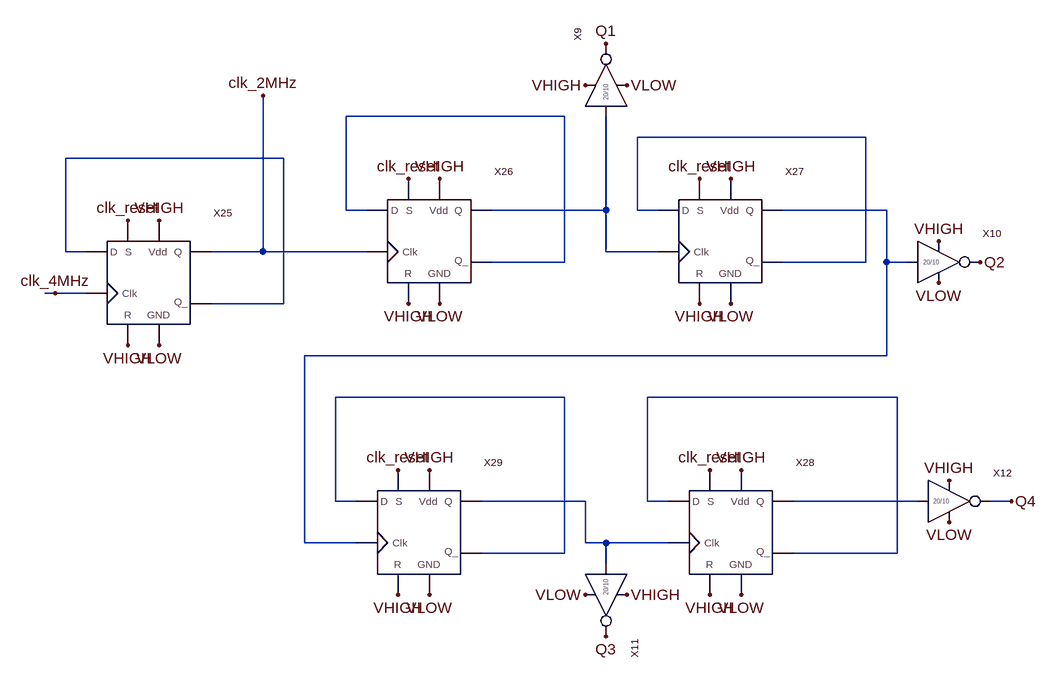
[diagram p0: schematic counter.asc]
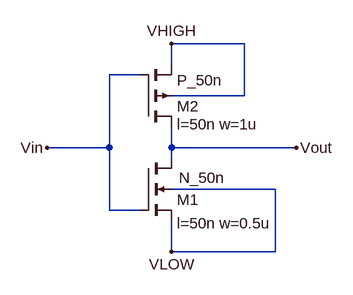
[diagram p1: sub-circuit inverter.asc]
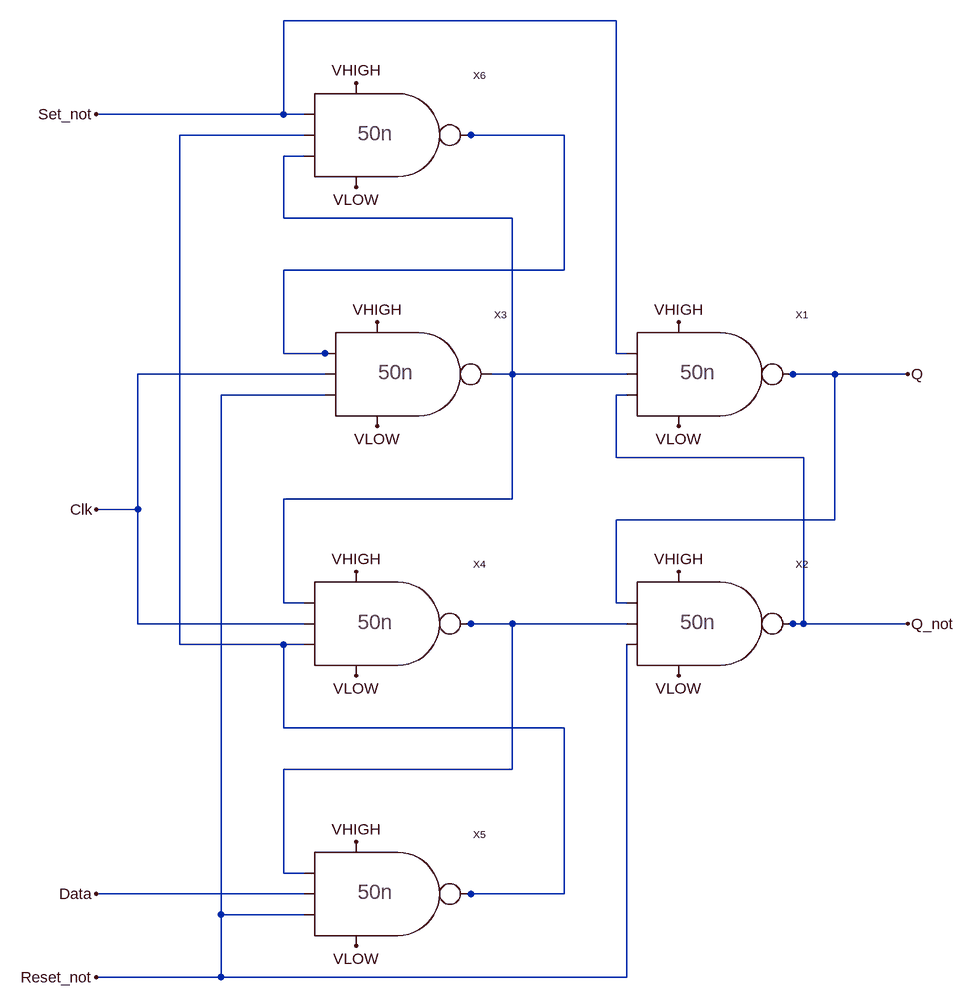
[diagram p2: sub-circuit ti_dff.asc]
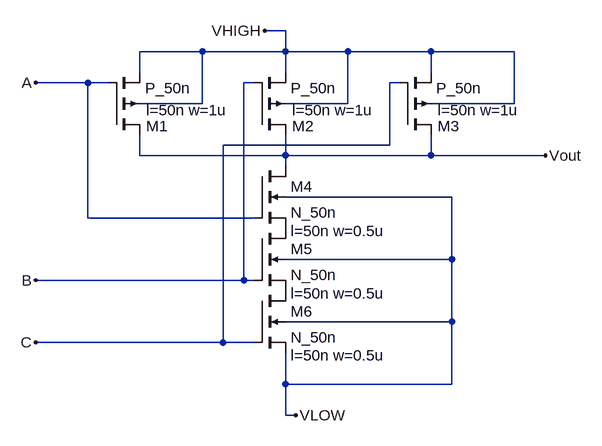
[diagram p3: sub-circuit nand3.asc]
counter.asc, the LTspice schematic file:
Version 4
SHEET 1 3052 1676
WIRE 720 -112 384 -112
WIRE 1184 -80 832 -80
WIRE 288 -48 -48 -48
WIRE 384 32 384 -112
WIRE 416 32 384 32
WIRE 784 32 784 -112
WIRE 784 32 608 32
WIRE 832 32 832 -80
WIRE 864 32 832 32
WIRE 1216 32 1056 32
WIRE -48 96 -48 -48
WIRE -16 96 -48 96
WIRE 256 96 256 -144
WIRE 256 96 176 96
WIRE 416 96 256 96
WIRE 784 96 784 32
WIRE 864 96 784 96
WIRE 720 112 720 -112
WIRE 720 112 608 112
WIRE 1184 112 1184 -80
WIRE 1184 112 1056 112
WIRE 1216 112 1216 32
WIRE 1248 112 1216 112
WIRE -64 160 -80 160
WIRE -16 160 -64 160
WIRE 288 176 288 -48
WIRE 288 176 176 176
WIRE 1216 256 1216 112
WIRE 1216 256 320 256
WIRE 720 320 368 320
WIRE 1232 320 848 320
WIRE 368 480 368 320
WIRE 400 480 368 480
WIRE 752 480 592 480
WIRE 848 480 848 320
WIRE 880 480 848 480
WIRE 1264 480 1072 480
WIRE 1408 480 1376 480
WIRE 320 544 320 256
WIRE 400 544 320 544
WIRE 752 544 752 480
WIRE 784 544 752 544
WIRE 880 544 784 544
WIRE 720 560 720 320
WIRE 720 560 592 560
WIRE 1232 560 1232 320
WIRE 1232 560 1072 560
WIRE 784 576 784 544
FLAG 784 -224 Q1
FLAG 1360 112 Q2
FLAG 784 688 Q3
FLAG 1408 480 Q4
FLAG 96 240 VLOW
FLAG 48 240 VHIGH
FLAG 96 48 VHIGH
FLAG 528 -16 VHIGH
FLAG 480 176 VHIGH
FLAG 752 -160 VHIGH
FLAG 528 176 VLOW
FLAG 816 -160 VLOW
FLAG 944 432 clk_reset
FLAG 464 432 clk_reset
FLAG 480 -16 clk_reset
FLAG 48 48 clk_reset
FLAG 928 -16 clk_reset
FLAG 976 -16 VHIGH
FLAG 992 432 VHIGH
FLAG 944 624 VHIGH
FLAG 464 624 VHIGH
FLAG 512 624 VLOW
FLAG 992 624 VLOW
FLAG 976 176 VLOW
FLAG 928 176 VHIGH
FLAG 512 432 VHIGH
FLAG 816 624 VHIGH
FLAG 752 624 VLOW
FLAG 1312 448 VHIGH
FLAG 1312 512 VLOW
FLAG 1296 144 VLOW
FLAG 1296 80 VHIGH
FLAG 256 -144 clk_2MHz
FLAG -64 160 clk_4MHz
SYMBOL Inverter 784 -128 R270
SYMATTR InstName X9
SYMBOL Inverter 1264 112 R0
SYMATTR InstName X10
SYMBOL Inverter 784 592 R90
SYMATTR InstName X11
SYMBOL Inverter 1280 480 R0
SYMATTR InstName X12
SYMBOL TI_DFF 80 144 R0
SYMATTR InstName X25
SYMBOL TI_DFF 512 80 R0
SYMATTR InstName X26
SYMBOL TI_DFF 960 80 R0
SYMATTR InstName X27
SYMBOL TI_DFF 976 528 R0
SYMATTR InstName X28
SYMBOL TI_DFF 496 528 R0
SYMATTR InstName X29

inverter.asc, the sub-circuit schematic file:
Version 4
SHEET 1 880 680
WIRE 336 -64 224 -64
WIRE 224 -32 224 -64
WIRE 176 -16 128 -16
WIRE 336 16 336 -64
WIRE 336 16 224 16
WIRE 128 96 128 -16
WIRE 128 96 32 96
WIRE 224 96 224 64
WIRE 416 96 224 96
WIRE 224 112 224 96
WIRE 384 160 224 160
WIRE 128 192 128 96
WIRE 176 192 128 192
WIRE 224 256 224 208
WIRE 384 256 384 160
WIRE 384 256 224 256
FLAG 32 96 Vin
FLAG 224 256 VLOW
FLAG 224 -64 VHIGH
FLAG 416 96 Vout
SYMBOL nmos4 176 112 R0
WINDOW 123 56 100 Left 2
WINDOW 0 56 64 Left 2
WINDOW 3 59 30 Left 2
SYMATTR Value2 l=50n w=0.5u
SYMATTR InstName M1
SYMATTR Value N_50n
SYMBOL pmos4 176 64 M180
WINDOW 123 56 4 Left 2
SYMATTR Value2 l=50n w=1u
SYMATTR InstName M2
SYMATTR Value P_50n

ti_dff.asc, the sub-circuit schematic file:
Version 4
SHEET 1 1216 1124
WIRE 160 -416 -352 -416
WIRE -352 -272 -352 -416
WIRE -352 -272 -640 -272
WIRE -320 -272 -352 -272
WIRE -320 -240 -512 -240
WIRE -64 -240 -80 -240
WIRE 80 -240 -64 -240
WIRE -320 -208 -352 -208
WIRE -352 -112 -352 -208
WIRE 0 -112 -352 -112
WIRE 80 -32 80 -240
WIRE 80 -32 -352 -32
WIRE -352 96 -352 -32
WIRE -288 96 -352 96
WIRE -272 96 -288 96
WIRE 160 96 160 -416
WIRE 176 96 160 96
WIRE -288 128 -576 128
WIRE 0 128 0 -112
WIRE 0 128 -32 128
WIRE 176 128 0 128
WIRE 432 128 416 128
WIRE 496 128 432 128
WIRE 608 128 496 128
WIRE -288 160 -448 160
WIRE 176 160 160 160
WIRE 160 256 160 160
WIRE 448 256 160 256
WIRE 0 320 0 128
WIRE 0 320 -352 320
WIRE -576 336 -576 128
WIRE -576 336 -640 336
WIRE 496 352 496 128
WIRE 496 352 160 352
WIRE -352 480 -352 320
WIRE -320 480 -352 480
WIRE 160 480 160 352
WIRE 176 480 160 480
WIRE -576 512 -576 336
WIRE -320 512 -576 512
WIRE -64 512 -80 512
WIRE 0 512 -64 512
WIRE 176 512 0 512
WIRE 432 512 416 512
WIRE 448 512 448 256
WIRE 448 512 432 512
WIRE 608 512 448 512
WIRE -512 544 -512 -240
WIRE -352 544 -512 544
WIRE -320 544 -352 544
WIRE -352 672 -352 544
WIRE 80 672 -352 672
WIRE 0 736 0 512
WIRE 0 736 -352 736
WIRE -352 896 -352 736
WIRE -320 896 -352 896
WIRE -320 928 -640 928
WIRE -64 928 -80 928
WIRE 80 928 80 672
WIRE 80 928 -64 928
WIRE -448 960 -448 160
WIRE -320 960 -448 960
WIRE -448 1056 -448 960
WIRE -448 1056 -640 1056
WIRE 176 1056 176 544
WIRE 176 1056 -448 1056
FLAG -640 -272 Set_not
FLAG -640 928 Data
FLAG -640 336 Clk
FLAG -640 1056 Reset_not
FLAG 608 128 Q
FLAG 608 512 Q_not
FLAG -240 848 VHIGH
FLAG -240 432 VHIGH
FLAG 256 432 VHIGH
FLAG -240 -320 VHIGH
FLAG -208 48 VHIGH
FLAG 256 48 VHIGH
FLAG -240 -160 VLOW
FLAG -208 208 VLOW
FLAG 256 208 VLOW
FLAG -240 1008 VLOW
FLAG 256 592 VLOW
FLAG -240 592 VLOW
SYMBOL NAND3 240 128 R0
SYMATTR InstName X1
SYMBOL NAND3 240 512 R0
SYMATTR InstName X2
SYMBOL NAND3 -224 128 R0
SYMATTR InstName X3
SYMBOL NAND3 -256 512 R0
SYMATTR InstName X4
SYMBOL NAND3 -256 928 R0
SYMATTR InstName X5
SYMBOL NAND3 -256 -240 R0
SYMATTR InstName X6

nand3.asc, the sub-circuit schematic file:
Version 4
SHEET 1 880 788
WIRE 320 -96 288 -96
WIRE 192 -64 96 -64
WIRE 320 -64 320 -96
WIRE 320 -64 192 -64
WIRE 416 -64 320 -64
WIRE 544 -64 416 -64
WIRE 672 -64 544 -64
WIRE 96 -32 96 -64
WIRE 320 -32 320 -64
WIRE 544 -32 544 -64
WIRE 16 -16 -64 -16
WIRE 48 -16 16 -16
WIRE 272 -16 256 -16
WIRE 496 -16 480 -16
WIRE 192 16 192 -64
WIRE 192 16 96 16
WIRE 416 16 416 -64
WIRE 416 16 320 16
WIRE 672 16 672 -64
WIRE 672 16 544 16
WIRE 480 80 480 -16
WIRE 480 80 224 80
WIRE 96 96 96 64
WIRE 320 96 320 64
WIRE 320 96 96 96
WIRE 544 96 544 64
WIRE 544 96 320 96
WIRE 720 96 544 96
WIRE 320 112 320 96
WIRE 576 160 320 160
WIRE 16 192 16 -16
WIRE 272 192 16 192
WIRE 576 256 576 160
WIRE 576 256 320 256
WIRE 256 288 256 -16
WIRE 256 288 -64 288
WIRE 272 288 256 288
WIRE 576 352 576 256
WIRE 576 352 320 352
WIRE 224 384 224 80
WIRE 224 384 -64 384
WIRE 272 384 224 384
WIRE 320 448 320 400
WIRE 576 448 576 352
WIRE 576 448 320 448
WIRE 320 496 320 448
WIRE 336 496 320 496
FLAG -64 -16 A
FLAG -64 288 B
FLAG -64 384 C
FLAG 720 96 Vout
FLAG 288 -96 VHIGH
FLAG 336 496 VLOW
SYMBOL pmos4 272 64 M180
WINDOW 0 58 13 Left 2
WINDOW 123 58 38 Left 2
SYMATTR InstName M2
SYMATTR Value2 l=50n w=1u
SYMATTR Value P_50n
SYMBOL pmos4 48 64 M180
WINDOW 0 58 13 Left 2
WINDOW 123 58 38 Left 2
SYMATTR InstName M1
SYMATTR Value2 l=50n w=1u
SYMATTR Value P_50n
SYMBOL pmos4 496 64 M180
WINDOW 0 58 13 Left 2
WINDOW 123 58 38 Left 2
SYMATTR InstName M3
SYMATTR Value2 l=50n w=1u
SYMATTR Value P_50n
SYMBOL nmos4 272 112 R0
WINDOW 123 56 100 Left 2
SYMATTR Value2 l=50n w=0.5u
SYMATTR InstName M4
SYMATTR Value N_50n
SYMBOL nmos4 272 208 R0
WINDOW 123 56 100 Left 2
SYMATTR Value2 l=50n w=0.5u
SYMATTR InstName M5
SYMATTR Value N_50n
SYMBOL nmos4 272 304 R0
WINDOW 123 56 100 Left 2
SYMATTR Value2 l=50n w=0.5u
SYMATTR InstName M6
SYMATTR Value N_50n

The netlist it stands for:
* counter.asc
XX9 VHIGH VLOW N004 Q1 inverter
XX10 VHIGH VLOW N005 Q2 inverter
XX11 VHIGH VLOW N008 Q3 inverter
XX12 VHIGH VLOW N009 Q4 inverter
XX25 clk_reset clk_4MHz N003 VHIGH clk_2MHz N003 VLOW VHIGH ti_dff
XX26 clk_reset clk_2MHz N001 VHIGH N004 N001 VLOW VHIGH ti_dff
XX27 clk_reset N004 N002 VHIGH N005 N002 VLOW VHIGH ti_dff
XX28 clk_reset N008 N007 VHIGH N009 N007 VLOW VHIGH ti_dff
XX29 clk_reset N005 N006 VHIGH N008 N006 VLOW VHIGH ti_dff

* block symbol definitions
.subckt inverter VHIGH VLOW Vin Vout
M1 Vout Vin VLOW VLOW N_50n l=50n w=0.5u
M2 Vout Vin VHIGH VHIGH P_50n l=50n w=1u
.ends inverter

.subckt ti_dff Set_not Clk Data Reset_not Q Q_not VLOW VHIGH
XX1 Set_not N003 Q_not Q VHIGH VLOW nand3
XX2 Q N004 Reset_not Q_not VHIGH VLOW nand3
XX3 N002 Clk Reset_not N003 VHIGH VLOW nand3
XX4 N003 Clk N001 N004 VHIGH VLOW nand3
XX5 N004 Data Reset_not N001 VHIGH VLOW nand3
XX6 Set_not N001 N003 N002 VHIGH VLOW nand3
.ends ti_dff

.subckt nand3 A B C Vout VHIGH VLOW
M2 Vout B VHIGH VHIGH P_50n l=50n w=1u
M1 Vout A VHIGH VHIGH P_50n l=50n w=1u
M3 Vout C VHIGH VHIGH P_50n l=50n w=1u
M4 Vout A P001 VLOW N_50n l=50n w=0.5u
M5 P001 B P002 VLOW N_50n l=50n w=0.5u
M6 P002 C VLOW VLOW N_50n l=50n w=0.5u
.ends nand3

.model NMOS NMOS
.model PMOS PMOS
.lib standard.mos
.backanno
.end